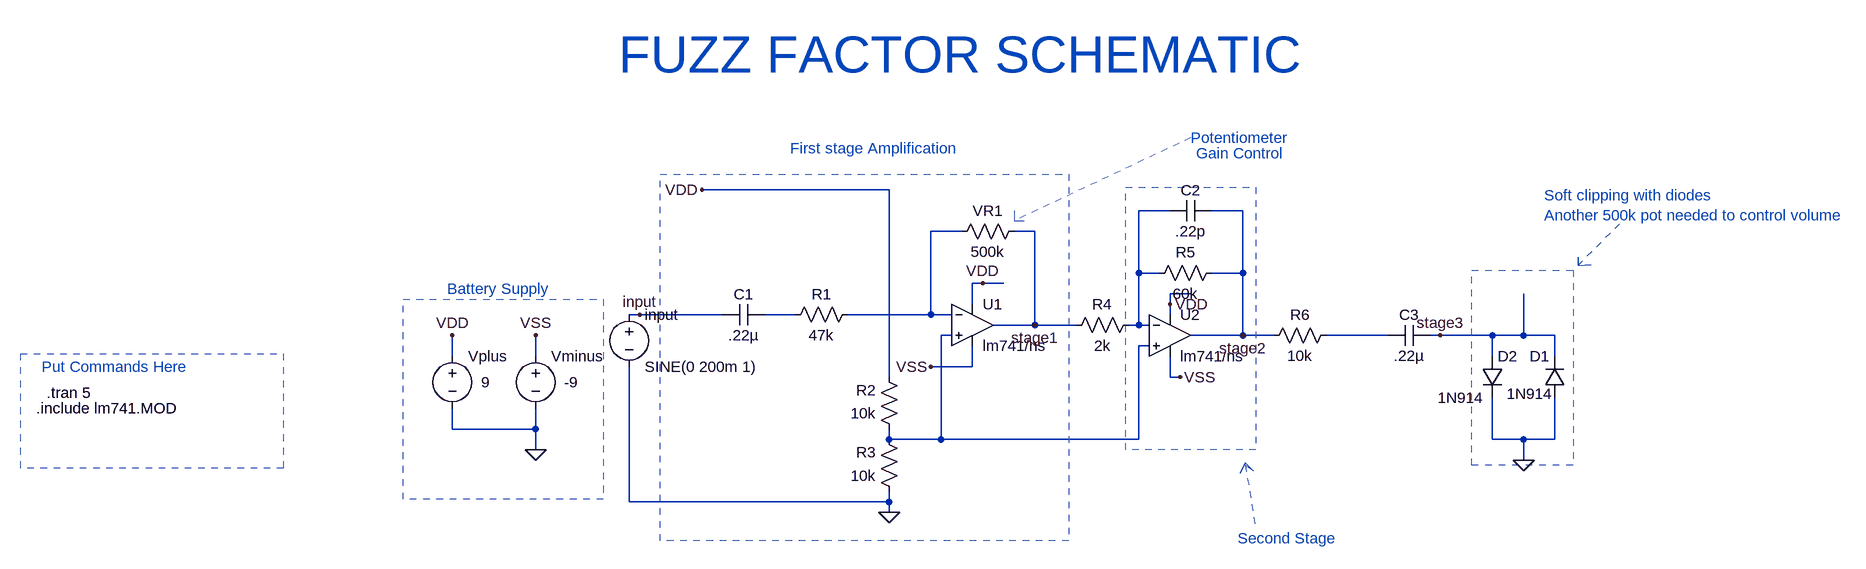
[diagram p0: schematic finalv1Sim.asc]
finalv1Sim.asc, the LTspice schematic file:
Version 4
SHEET 1 3628 744
WIRE 1232 192 944 192
WIRE 1664 224 1616 224
WIRE 1776 224 1728 224
WIRE 1344 256 1296 256
WIRE 1456 256 1424 256
WIRE 1616 320 1616 224
WIRE 1648 320 1616 320
WIRE 1776 320 1776 224
WIRE 1776 320 1728 320
WIRE 1376 336 1360 336
WIRE 1408 336 1376 336
WIRE 1696 352 1664 352
WIRE 1360 368 1360 336
WIRE 1664 368 1664 352
WIRE 848 384 832 384
WIRE 976 384 848 384
WIRE 1088 384 1040 384
WIRE 1296 384 1296 256
WIRE 1296 384 1168 384
WIRE 1328 384 1296 384
WIRE 1664 384 1664 368
WIRE 1456 400 1456 256
WIRE 1456 400 1392 400
WIRE 1520 400 1456 400
WIRE 1616 400 1616 320
WIRE 1616 400 1600 400
WIRE 1632 400 1616 400
WIRE 1328 416 1312 416
WIRE 1776 416 1776 320
WIRE 1776 416 1696 416
WIRE 1824 416 1776 416
WIRE 2000 416 1904 416
WIRE 2080 416 2064 416
WIRE 2160 416 2080 416
WIRE 2208 416 2208 352
WIRE 2208 416 2160 416
WIRE 2256 416 2208 416
WIRE 1632 432 1616 432
WIRE 560 448 560 416
WIRE 688 448 688 416
WIRE 2160 448 2160 416
WIRE 2256 448 2256 416
WIRE 1360 464 1360 432
WIRE 1360 464 1296 464
WIRE 1232 480 1232 192
WIRE 1664 480 1664 448
WIRE 1680 480 1664 480
WIRE 560 560 560 528
WIRE 688 560 688 528
WIRE 688 560 560 560
WIRE 1232 576 1232 560
WIRE 1312 576 1312 416
WIRE 1312 576 1232 576
WIRE 1616 576 1616 432
WIRE 1616 576 1312 576
WIRE 2160 576 2160 512
WIRE 2208 576 2160 576
WIRE 2256 576 2256 512
WIRE 2256 576 2208 576
WIRE 688 592 688 560
WIRE 2208 608 2208 576
WIRE 832 672 832 464
WIRE 1232 672 1232 656
WIRE 1232 672 832 672
WIRE 1232 688 1232 672
FLAG 688 592 0
FLAG 560 416 VDD
FLAG 688 416 VSS
FLAG 1376 336 VDD
FLAG 944 192 VDD
FLAG 1232 688 0
FLAG 848 384 input
FLAG 1664 368 VDD
FLAG 1680 480 VSS
FLAG 1296 464 VSS
FLAG 1456 400 stage1
FLAG 1776 416 stage2
FLAG 2080 416 stage3
FLAG 2208 608 0
SYMBOL voltage 560 432 R0
WINDOW 123 0 0 Left 2
WINDOW 39 0 0 Left 2
WINDOW 3 44 56 Left 2
SYMATTR Value 9
SYMATTR InstName Vplus
SYMBOL voltage 688 432 R0
WINDOW 123 0 0 Left 2
WINDOW 39 0 0 Left 2
WINDOW 3 44 56 Left 2
SYMATTR Value -9
SYMATTR InstName Vminus
SYMBOL opamp2 1360 336 R0
SYMATTR InstName U1
SYMATTR Value lm741/ns
SYMBOL Res 1184 368 R90
WINDOW 0 0 56 VBottom 2
WINDOW 3 32 56 VTop 2
SYMATTR InstName R1
SYMATTR Value 47k
SYMBOL Res 1248 576 R180
WINDOW 0 36 76 Left 2
WINDOW 3 36 40 Left 2
SYMATTR InstName R2
SYMATTR Value 10k
SYMBOL Res 1248 672 R180
WINDOW 0 36 76 Left 2
WINDOW 3 36 40 Left 2
SYMATTR InstName R3
SYMATTR Value 10k
SYMBOL Cap 1040 368 R90
WINDOW 0 0 32 VBottom 2
WINDOW 3 32 32 VTop 2
SYMATTR InstName C1
SYMATTR Value .22µ
SYMBOL Voltage 832 368 R0
WINDOW 123 0 0 Left 0
WINDOW 39 0 0 Left 0
SYMATTR InstName input
SYMATTR Value SINE(0 200m 1)
SYMBOL Res 1440 240 R90
WINDOW 0 0 56 VBottom 2
WINDOW 3 32 56 VTop 2
SYMATTR InstName VR1
SYMATTR Value 500k
SYMBOL Res 1616 384 R90
WINDOW 0 0 56 VBottom 2
WINDOW 3 32 56 VTop 2
SYMATTR InstName R4
SYMATTR Value 2k
SYMBOL opamp2 1664 352 R0
SYMATTR InstName U2
SYMATTR Value lm741/ns
SYMBOL res 1744 304 R90
WINDOW 0 0 56 VBottom 2
WINDOW 3 32 56 VTop 2
SYMATTR InstName R5
SYMATTR Value 60k
SYMBOL res 1920 400 R90
WINDOW 0 0 56 VBottom 2
WINDOW 3 32 56 VTop 2
SYMATTR InstName R6
SYMATTR Value 10k
SYMBOL diode 2272 512 R180
WINDOW 0 24 64 Left 2
WINDOW 3 125 0 Left 2
SYMATTR InstName D1
SYMATTR Value 1N914
SYMBOL diode 2144 448 R0
WINDOW 3 38 58 Left 2
SYMATTR Value 1N914
SYMATTR InstName D2
SYMBOL Cap 2064 400 R90
WINDOW 0 0 32 VBottom 2
WINDOW 3 32 32 VTop 2
SYMATTR InstName C3
SYMATTR Value .22µ
SYMBOL Cap 1664 240 R270
WINDOW 0 32 32 VTop 2
WINDOW 3 0 32 VBottom 2
SYMATTR InstName C2
SYMATTR Value .22p
TEXT -80 528 Left 2 !.include lm741.MOD
TEXT -64 504 Left 2 !.tran 5
TEXT -72 464 Left 2 ;Put Commands Here
TEXT 552 344 Left 2 ;Battery Supply
TEXT 1080 128 Left 2 ;First stage Amplification
TEXT 816 -16 Left 6 ;FUZZ FACTOR SCHEMATIC
TEXT 1696 112 Left 2 ;Potentiometer
TEXT 1704 136 Left 2 ;Gain Control
TEXT 1768 728 Left 2 ;Second Stage
TEXT 2240 200 Left 2 ;Soft clipping with diodes\nAnother 500k pot needed to control volume
LINE Normal 1424 240 1424 240 2
LINE Normal 1696 112 1424 240 2
LINE Normal 1424 224 1424 240 2
LINE Normal 1440 240 1424 240 2
LINE Normal 1780 612 1772 628 2
LINE Normal 1772 628 1780 612 2
LINE Normal 1780 612 1792 624 2
LINE Normal 1792 624 1780 616 2
LINE Normal 1780 616 1796 716 2
LINE Normal 2292 308 2292 296 2
LINE Normal 2292 296 2292 308 2
LINE Normal 2292 308 2312 308 2
LINE Normal 2312 308 2292 308 2
LINE Normal 2292 308 2356 244 2
RECTANGLE Normal 484 360 792 668 2
RECTANGLE Normal 880 168 1508 732 2
RECTANGLE Normal -104 444 300 620 2
RECTANGLE Normal 1596 188 1796 592 2
RECTANGLE Normal 2128 316 2284 616 2

The netlist it stands for:
* finalv1Sim.asc
Vplus VDD 0 9
Vminus VSS 0 -9
XU1 N004 N002 VDD VSS stage1 lm741/ns  ; pins In+ In- V+ V- OUT
R1 N002 N003 47k
R2 N004 VDD 10k
R3 0 N004 10k
C1 N003 input .22µ
V§input input 0 SINE(0 200m 1)
R§VR1 stage1 N002 500k
R4 N001 stage1 2k
XU2 N004 N001 VDD VSS stage2 lm741/ns  ; pins In+ In- V+ V- OUT
R5 stage2 N001 60k
R6 N005 stage2 10k
D1 0 stage3 1N914
D2 stage3 0 1N914
C3 stage3 N005 .22µ
C2 N001 stage2 .22p
.model D D
.lib standard.dio
.include lm741.MOD
.tran 5
* Put Commands Here
* Battery Supply
* First stage Amplification
* FUZZ FACTOR SCHEMATIC
* Potentiometer
* Gain Control
* Second Stage
* Soft clipping with diodes
* Another 500k pot needed to control volume
.backanno
.end